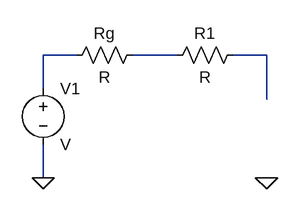
[diagram p0: schematic simulacion_diodo.asc]
simulacion_diodo.asc, the LTspice schematic file:
Version 4
SHEET 1 880 680
WIRE 64 128 16 128
WIRE 208 128 144 128
WIRE 336 128 288 128
WIRE 16 176 16 128
WIRE 336 192 336 128
WIRE 16 304 16 256
FLAG 16 304 0
FLAG 336 304 0
SYMBOL res 160 112 R90
WINDOW 0 0 56 VBottom 2
WINDOW 3 32 56 VTop 2
SYMATTR InstName Rg
SYMBOL res 304 112 R90
WINDOW 0 0 56 VBottom 2
WINDOW 3 32 56 VTop 2
SYMATTR InstName R1
SYMBOL voltage 16 160 R0
SYMATTR InstName V1

The netlist it stands for:
* simulacion_diodo.asc
Rg N002 N001 R
R1 N003 N002 R
V1 N001 0 V
.backanno
.end